# EAGLE design shield_008 (EAGLE 7.3.0)
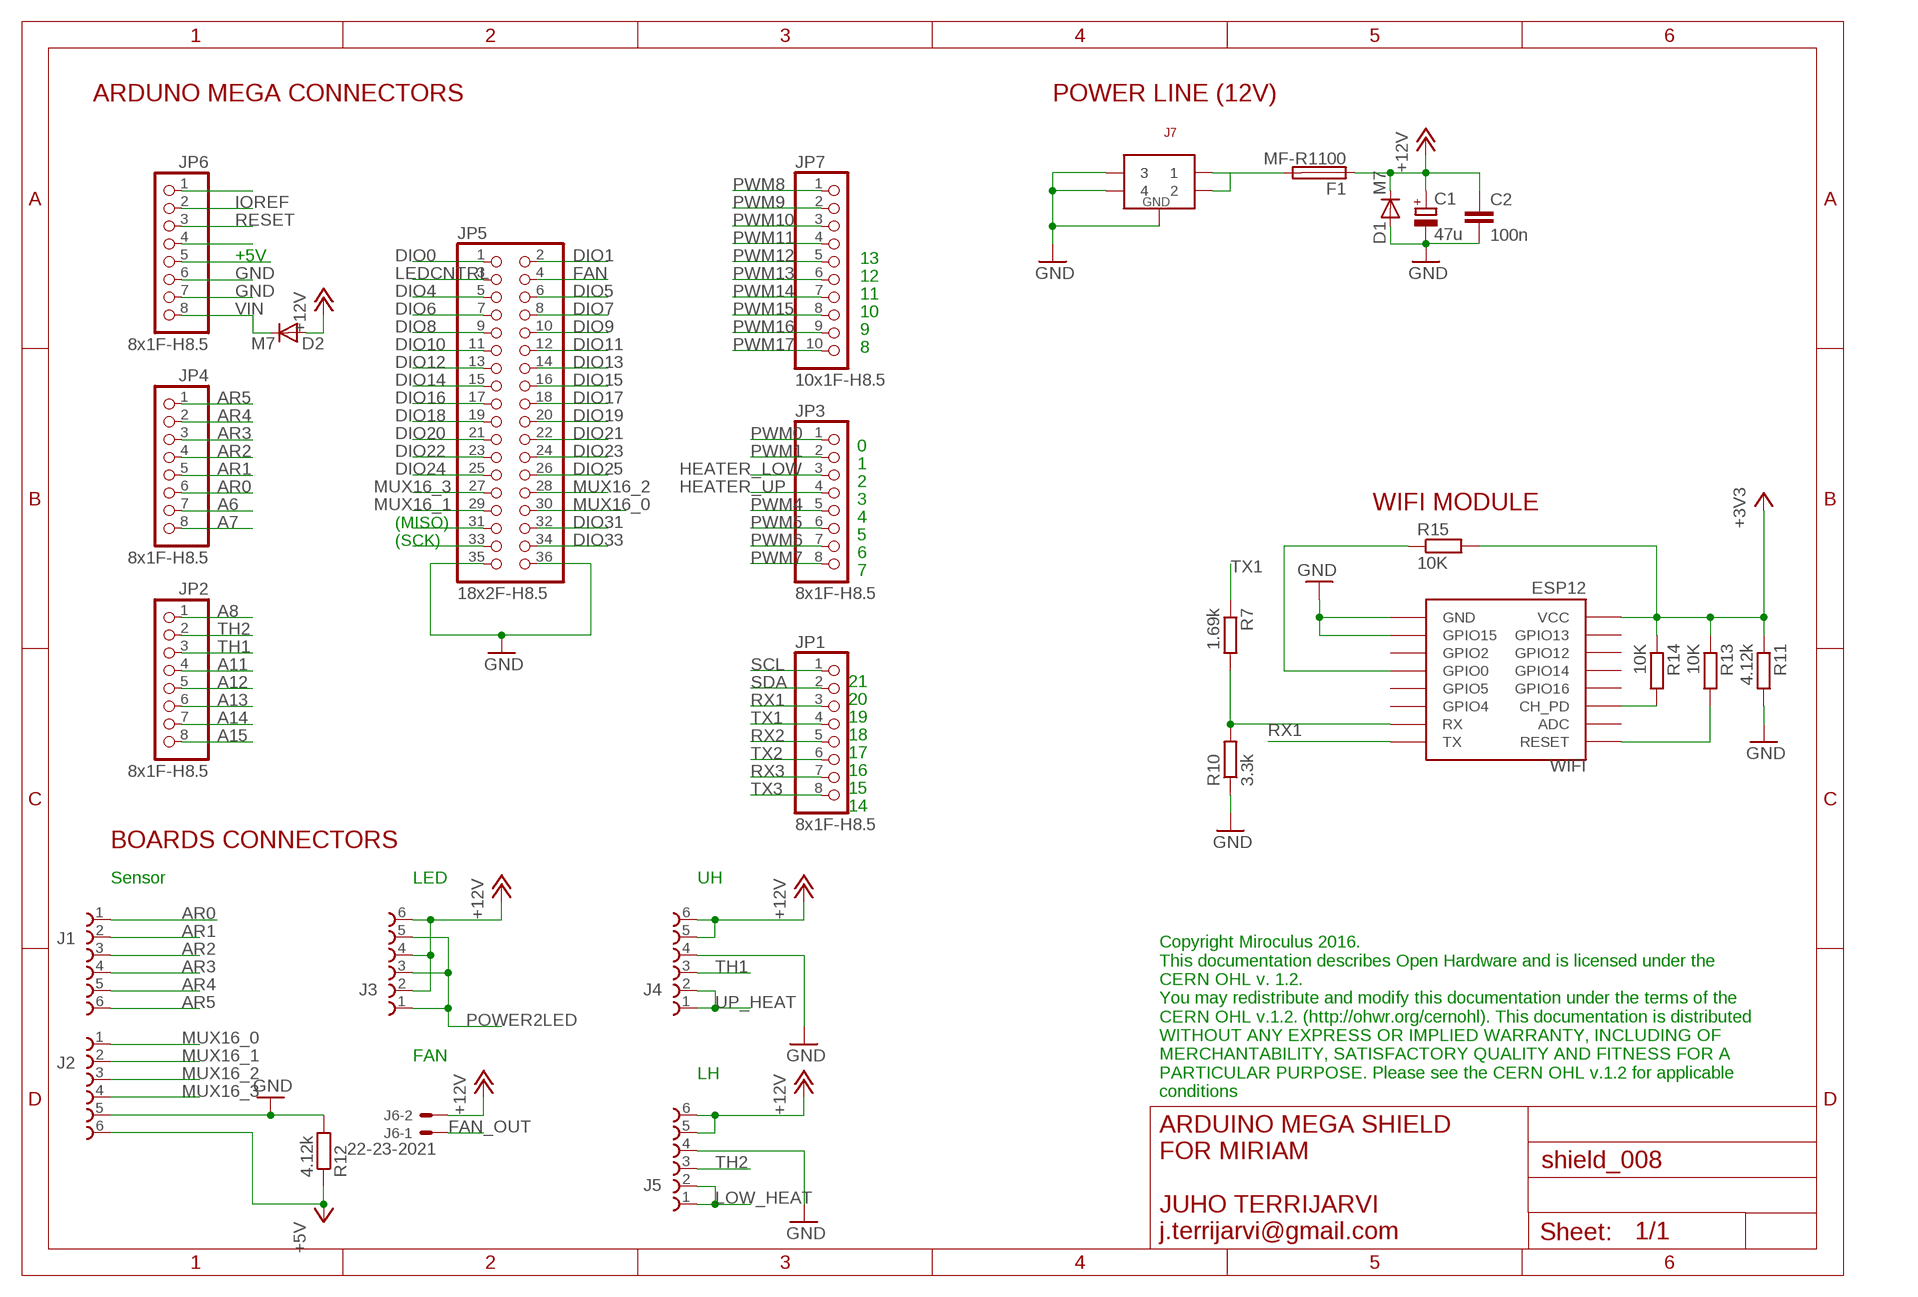
[diagram p0: schematic, sheet 1, part 1 of 2]
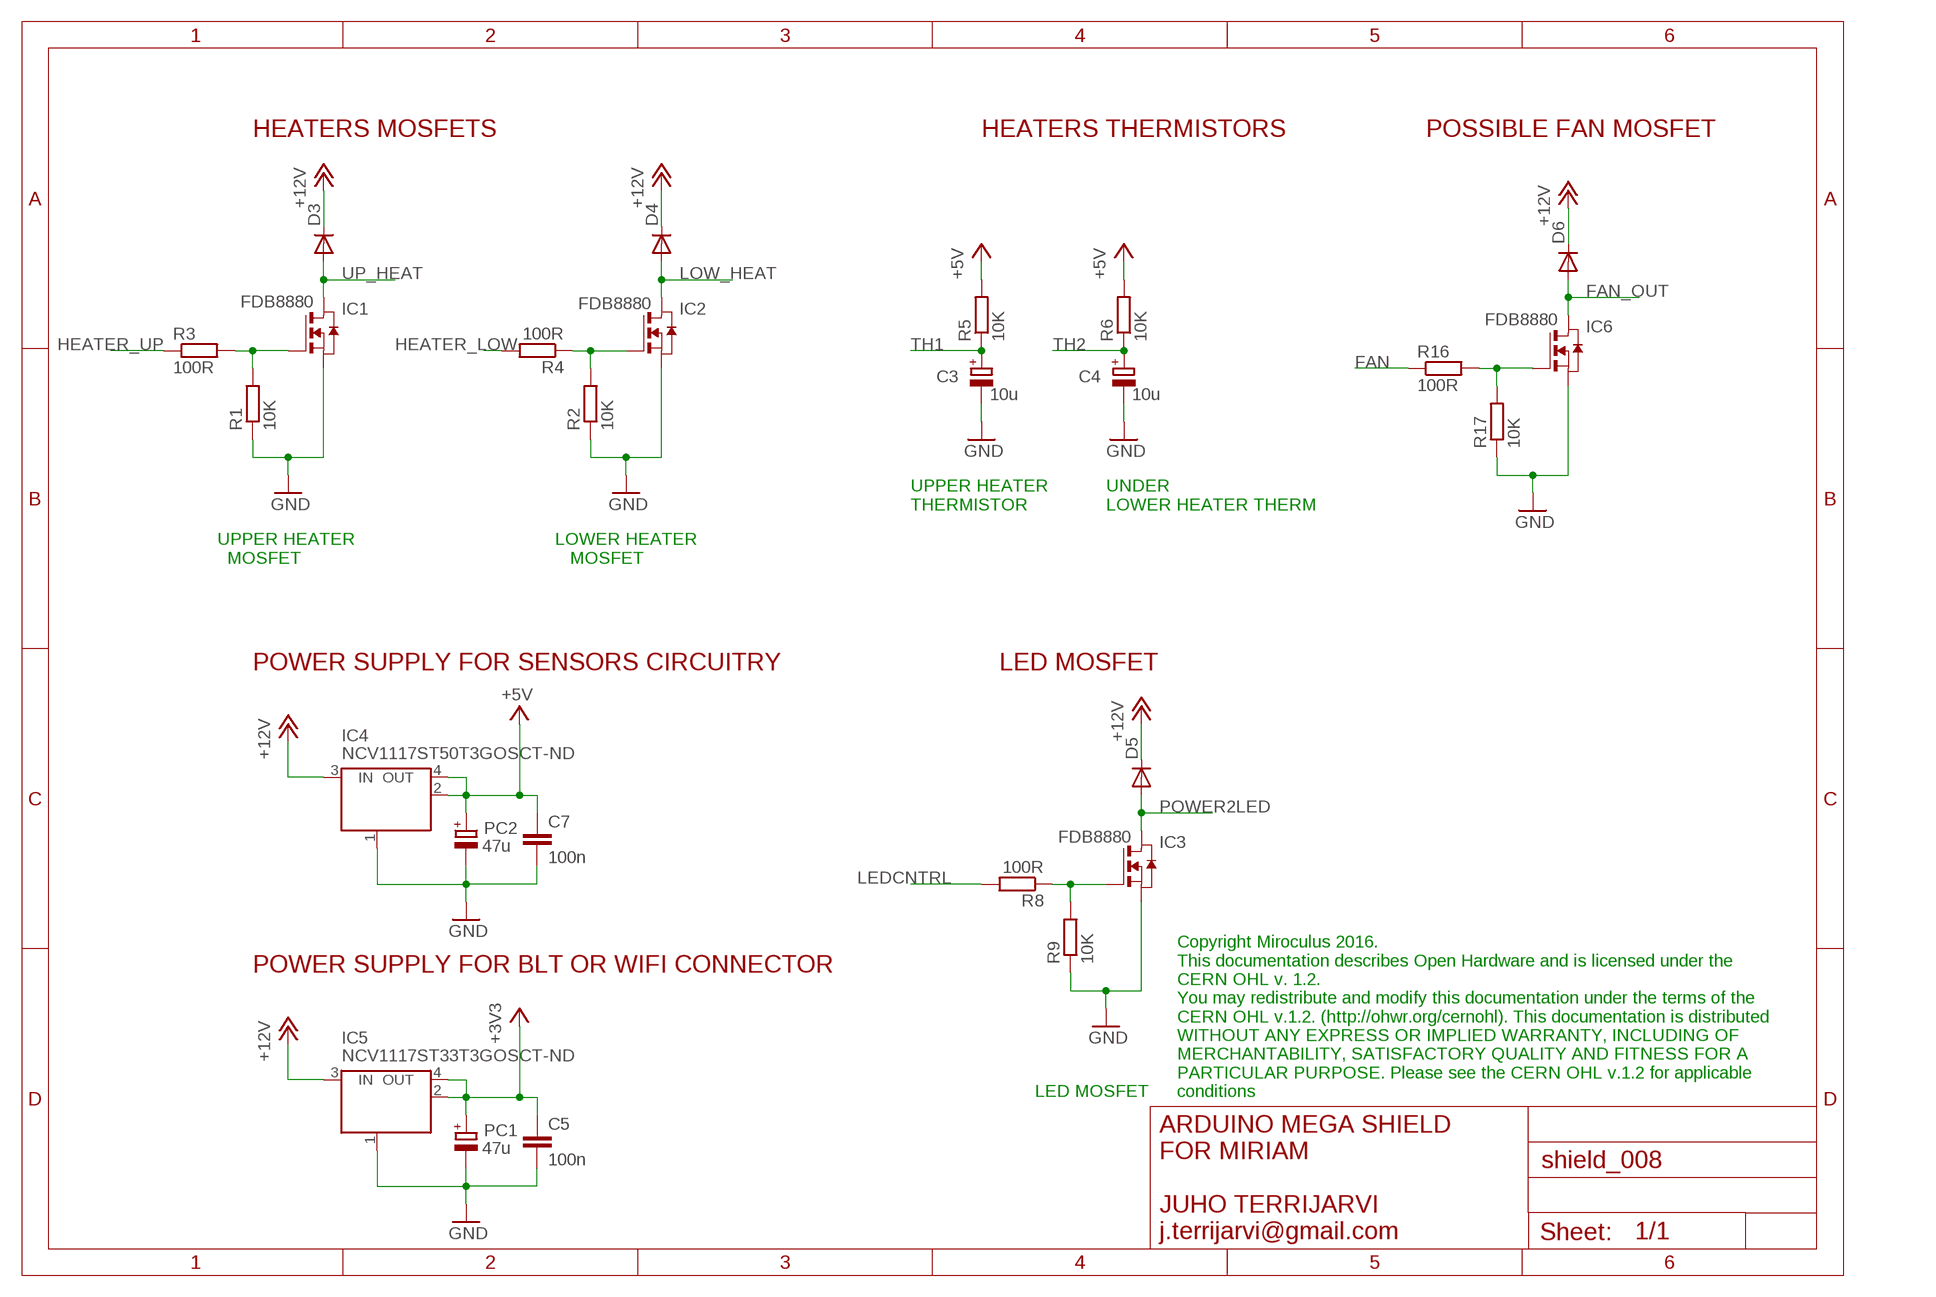
[diagram p1: schematic, sheet 1, part 2 of 2]

## Parts
C1  47u  CPOL-EUD  [PANASONIC_D]
C2  100n  C-EUC0603  [C0603]
C3  10u  CPOL-EUA/3216-18R  [A/3216-18R]
C4  10u  CPOL-EUA/3216-18R  [A/3216-18R]
C5  100n  C-EUC0603  [C0603]
C7  100n  C-EUC0603  [C0603]
D1  M7  DIODE-SMB  [SMB]
D2  M7  DIODE-SMB  [SMB]
D3  RGL34A  DO-213_DIODE  [DO-213AA_DIODE]
D4  RGL34A  DO-213_DIODE  [DO-213AA_DIODE]
D5  RGL34A  DO-213_DIODE  [DO-213AA_DIODE]
D6  RGL34A  DO-213_DIODE  [DO-213AA_DIODE]
F1  MF-R1100  LITTLEFUSE  [LITTLEFUSE]
IC1  FDB8880  [FDB8880]
IC2  FDB8880  [FDB8880]
IC3  FDB8880  [FDB8880]
IC4  NCV1117ST50T3GOSCT-ND  MC33269ST-3.3T3  [SOT223]
IC5  NCV1117ST33T3GOSCT-ND  MC33269ST-3.3T3  [SOT223]
IC6  FDB8880  [FDB8880]
J1  68710614522  [68710614522]
J2  68710614522  [68710614522]
J3  68710614522  [68710614522]
J4  68710614522  [68710614522]
J5  68710614522  [68710614522]
J6  22-23-2021  [22-23-2021]
J7  KPJX-4S-S  [KPJX-4S-S]
JP1  8x1F-H8.5  PINHD-1X8  [1X08]
JP2  8x1F-H8.5  PINHD-1X8  [1X08]
JP3  8x1F-H8.5  PINHD-1X8  [1X08]
JP4  8x1F-H8.5  PINHD-1X8  [1X08]
JP5  18x2F-H8.5  PINHD-2X18  [2X18]
JP6  8x1F-H8.5  PINHD-1X8  [1X08]
JP7  10x1F-H8.5  PINHD-1X10_ARD  [1X10]
PC1  47u  CPOL-EUD  [PANASONIC_D]
PC2  47u  CPOL-EUD  [PANASONIC_D]
R1  10K  R-EU_R0603  [R0603]
R2  10K  R-EU_R0603  [R0603]
R3  100R  R-EU_R0603  [R0603]
R4  100R  R-EU_R0603  [R0603]
R5  10K  R-EU_R0603  [R0603]
R6  10K  R-EU_R0603  [R0603]
R7  1.69k  R-EU_R0603  [R0603]
R8  100R  R-EU_R0603  [R0603]
R9  10K  R-EU_R0603  [R0603]
R10  3.3k  R-EU_R0603  [R0603]
R11  4.12k  R-EU_R0603  [R0603]
R12  4.12k  R-EU_R0603  [R0603]
R13  10K  R-EU_R0603  [R0603]
R14  10K  R-EU_R0603  [R0603]
R15  10K  R-EU_R0603  [R0603]
R16  100R  R-EU_R0603  [R0603]
R17  10K  R-EU_R0603  [R0603]
WIFI  ESP12  [ESP12]

## Nets
+3V3: C5.1 IC5.2(OUT) IC5.4(OUT) PC1.+ R11.1 R13.1 R14.1 R15.2 WIFI.VCC
+5V: C7.1 IC4.2(OUT) IC4.4(OUT) J2.6 PC2.+ R5.2 R6.2 R12.1
+12V: C1.+ C2.1 D1.C D2.A D3.P$2(C) D4.P$2(C) D5.P$2(C) D6.P$2(C) F1.1 IC4.3(IN) IC5.3(IN) J3.2 J3.4 J3.6 J4.5 J4.6 J5.5 J5.6 J6.2
A6: JP4.7
A7: JP4.8
A8: JP2.1
A11: JP2.4
A12: JP2.5
A13: JP2.6
A14: JP2.7
A15: JP2.8
AR0: J1.1 JP4.6
AR1: J1.2 JP4.5
AR2: J1.3 JP4.4
AR3: J1.4 JP4.3
AR4: J1.5 JP4.2
AR5: J1.6 JP4.1
DIO0: JP5.1
DIO1: JP5.2
DIO4: JP5.5
DIO5: JP5.6
DIO6: JP5.7
DIO7: JP5.8
DIO8: JP5.9
DIO9: JP5.10
DIO10: JP5.11
DIO11: JP5.12
DIO12: JP5.13
DIO13: JP5.14
DIO14: JP5.15
DIO15: JP5.16
DIO16: JP5.17
DIO17: JP5.18
DIO18: JP5.19
DIO19: JP5.20
DIO20: JP5.21
DIO21: JP5.22
DIO22: JP5.23
DIO23: JP5.24
DIO24: JP5.25
DIO25: JP5.26
DIO30: JP5.31
DIO31: JP5.32
DIO32: JP5.33
DIO33: JP5.34
FAN: JP5.4 R16.1
FAN_OUT: D6.P$1(A) IC6.2(D) J6.1
GND: C1.- C2.2 C3.- C4.- C5.2 C7.2 D1.A IC1.3(S) IC2.3(S) IC3.3(S) IC4.1(GND/ADJ) IC5.1(GND/ADJ) IC6.3(S) J2.5 J4.4 J5.4 J7.P$3 J7.P$4 J7.P$5(G) J7.P$6(G) J7.P$7(G) JP5.35 JP5.36 JP6.6 JP6.7 PC1.- PC2.- R1.1 R2.1 R9.1 R10.1 R11.2 R12.2 R17.1 WIFI.GND WIFI.GPIO15
HEATER_LOW: JP3.3 R4.2
HEATER_UP: JP3.4 R3.1
IOREF: JP6.2
LEDCNTRL: JP5.3 R8.2
LOW_HEAT: D4.P$1(A) IC2.2(D) J5.1 J5.2
MUX16_0: J2.1 JP5.30
MUX16_1: J2.2 JP5.29
MUX16_2: J2.3 JP5.28
MUX16_3: J2.4 JP5.27
N$1: JP6.1
N$2: JP6.5
N$4: IC3.1(G) R8.1 R9.2
N$5: R7.2 R10.2 WIFI.RX
N$6: JP6.4
N$10: R13.2 WIFI.RESET
N$11: R14.2 WIFI.CH_PD
N$13: R15.1 WIFI.GPIO0
N$14: F1.2 J7.P$1 J7.P$2
N$15: IC6.1(G) R16.2 R17.2
N$18: IC1.1(G) R1.2 R3.2
N$19: IC2.1(G) R2.2 R4.1
POWER2LED: D5.P$1(A) IC3.2(D) J3.1 J3.3 J3.5
PWM0: JP3.1
PWM1: JP3.2
PWM4: JP3.5
PWM5: JP3.6
PWM6: JP3.7
PWM7: JP3.8
PWM8: JP7.1
PWM9: JP7.2
PWM10: JP7.3
PWM11: JP7.4
PWM12: JP7.5
PWM13: JP7.6
PWM14: JP7.7
PWM15: JP7.8
PWM16: JP7.9
PWM17: JP7.10
RESET: JP6.3
RX1: JP1.3 WIFI.TX
RX2: JP1.5
RX3: JP1.7
SCL: JP1.1
SDA: JP1.2
TH1: C3.+ J4.3 JP2.3 R5.1
TH2: C4.+ J5.3 JP2.2 R6.1
TX1: JP1.4 R7.1
TX2: JP1.6
TX3: JP1.8
UP_HEAT: D3.P$1(A) IC1.2(D) J4.1 J4.2
VIN: D2.C JP6.8
Unconnected: WIFI.ADC WIFI.GPIO2 WIFI.GPIO4 WIFI.GPIO5 WIFI.GPIO12 WIFI.GPIO13 WIFI.GPIO14 WIFI.GPIO16

## Notes on the sheet
- ARDUNO MEGA CONNECTORS | POWER LINE (12V)
- HEATERS MOSFETS | HEATERS THERMISTORS | POSSIBLE FAN MOSFET
- +5V | 13
- 12
- 11
- 10
- 9
- 8
- 0
- 1
- 2
- 3
- 4 | WIFI MODULE
- UPPER HEATER
  THERMISTOR
- UNDER
  LOWER HEATER THERM
- (MISO) | 5
- (SCK) | 6
- 7
- UPPER HEATER
    MOSFET
- LOWER HEATER
     MOSFET
- 21 | POWER SUPPLY FOR SENSORS CIRCUITRY | LED MOSFET
- 20
- 19
- 18
- 17
- 16
- 15
- 14
- BOARDS CONNECTORS
- Sensor | LED | UH
- POWER SUPPLY FOR BLT OR WIFI CONNECTOR
- FAN
- LH
- Copyright Miroculus 2016.
  This documentation describes Open Hardware and is licensed under the
  CERN OHL v. 1.2.
  You may redistribute and modify this documentation under the terms of the
  CERN OHL v.1.2. (http://ohwr.org/cernohl). This documentation is distributed
  WITHOUT ANY EXPRESS OR IMPLIED WARRANTY, INCLUDING OF
  MERCHANTABILITY, SATISFACTORY QUALITY AND FITNESS FOR A
  PARTICULAR PURPOSE. Please see the CERN OHL v.1.2 for applicable
  conditions
- LED MOSFET
- Copyright Miroculus 2016.
  This documentation describes Open Hardware and is licensed under the
  CERN OHL v. 1.2.
  You may redistribute and modify this documentation under the terms of the
  CERN OHL v.1.2. (http://ohwr.org/cernohl). This documentation is distributed
  WITHOUT ANY EXPRESS OR IMPLIED WARRANTY, INCLUDING OF
  MERCHANTABILITY, SATISFACTORY QUALITY AND FITNESS FOR A
  PARTICULAR PURPOSE. Please see the CERN OHL v.1.2 for applicable
  conditions
- ARDUINO MEGA SHIELD
  FOR MIRIAM
  
  JUHO TERRIJARVI
  j.terrijarvi@gmail.com
- ARDUINO MEGA SHIELD
  FOR MIRIAM
  
  JUHO TERRIJARVI
  j.terrijarvi@gmail.com

## Library data of the parts
C1 C3 C4 PC1 PC2 = rcl:CPOL-EU: POLARIZED CAPACITOR, European symbol
C2 C5 C7 = rcl:C-EU: CAPACITOR, European symbol
D1 D2 = diode:DIODE-: DIODE
D3-D6 = verkstad:DO-213_DIODE: RGL34A thru RGL34K Surface Mount Glass Passivated Junction Fast Switching Rectifier
F1 = fuse:LITTLEFUSE: LITTLEFUSE Picofuse/slow Littlefuse; FARNELL: 1652183; OC_FARNELL: unknown; OC_NEWARK: unknown
IC1-IC3 IC6 = verkstad:FDB8880: FDB8880 N-Channel PowerTrench MOSFET This N-Channel MOSFET has been designed specifically to improve the overall efficiency of DC/DC converters using either synchronous or conventional switching PWM controllers. It has been optimized for low gate charge, low rDS(ON) and fast switching speed. Digikey Part Number: FDD8880CT-ND
IC4 IC5 = linear:MC33269ST*: Adjustable Output Low Dropout Voltage Regulator 800 mA Source: http://www.onsemi.com/pub/Collateral/MC33269-D.PDF
J1-J5 = Eagle_FPC_CONNECTOR_AND_FFC_CAB (rev18c):68710614522: WE-FPC 0.5mm SMT ZIF Horizontal Bottom Contact, 6 Pins=>Code : Con_FPC_ZIF_0.50_68710614522 <http://katalog.we-online.de/media/images/eican/Con_FPC_ZIF_0.50_6871xx14522_pf2.jpg> Details see: http://katalog.we-online.de/en/em/687_1xx_145_22 Created 2014-07-09, Karrer Zheng 2014 (C) Würth Elektronik
J6 = con-molex:22-23-2021: .100" (2.54mm) Center Header - 2 Pin; MF: MOLEX; MPN: 22-23-2021; OC_FARNELL: 1462926; OC_NEWARK: 25C3832
J7 = KPJX-4S-S:KPJX-4S-S; AVAILABILITY: Unavailable; DESCRIPTION: 4 _Power_ Position Circular Connector Jack, Female Sockets Solder; MF: Kycon; MP: KPJX-4S-S; PACKAGE: SOIC-20 Kycon; PRICE: None
JP1-JP4 JP6 = SmartPrj:PINHD-1X8: PIN HEADER
JP5 = SmartPrj:PINHD-2X18: PIN HEADER
JP7 = SmartPrj:PINHD-1X10_ARD: PIN HEADER
R1-R17 = rcl:R-EU_: RESISTOR, European symbol
WIFI = esp8266modules:ESP12: ESP8266 Wifi module 12

## Net classes
1 power: width 0.61 mm, drill 0.406 mm, clearance 0.203 mm
2 gnd: width 0.305 mm, drill 0.406 mm, clearance 0.203 mm
3 power usb: width 0.508 mm, drill 0.406 mm, clearance 0.203 mm
4 power12: width 1.905 mm, drill 0.813 mm, clearance 0.203 mm

## Board
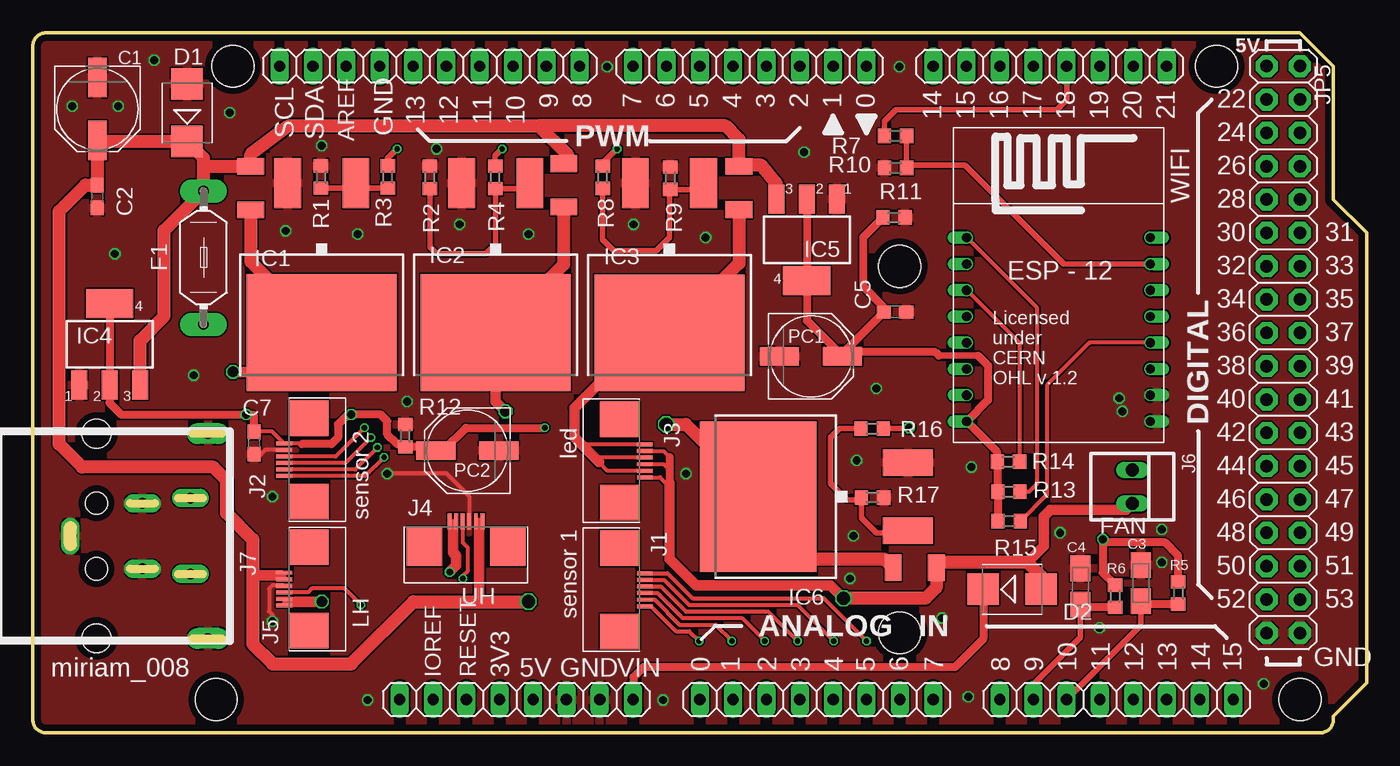
[diagram p2: board, top side]
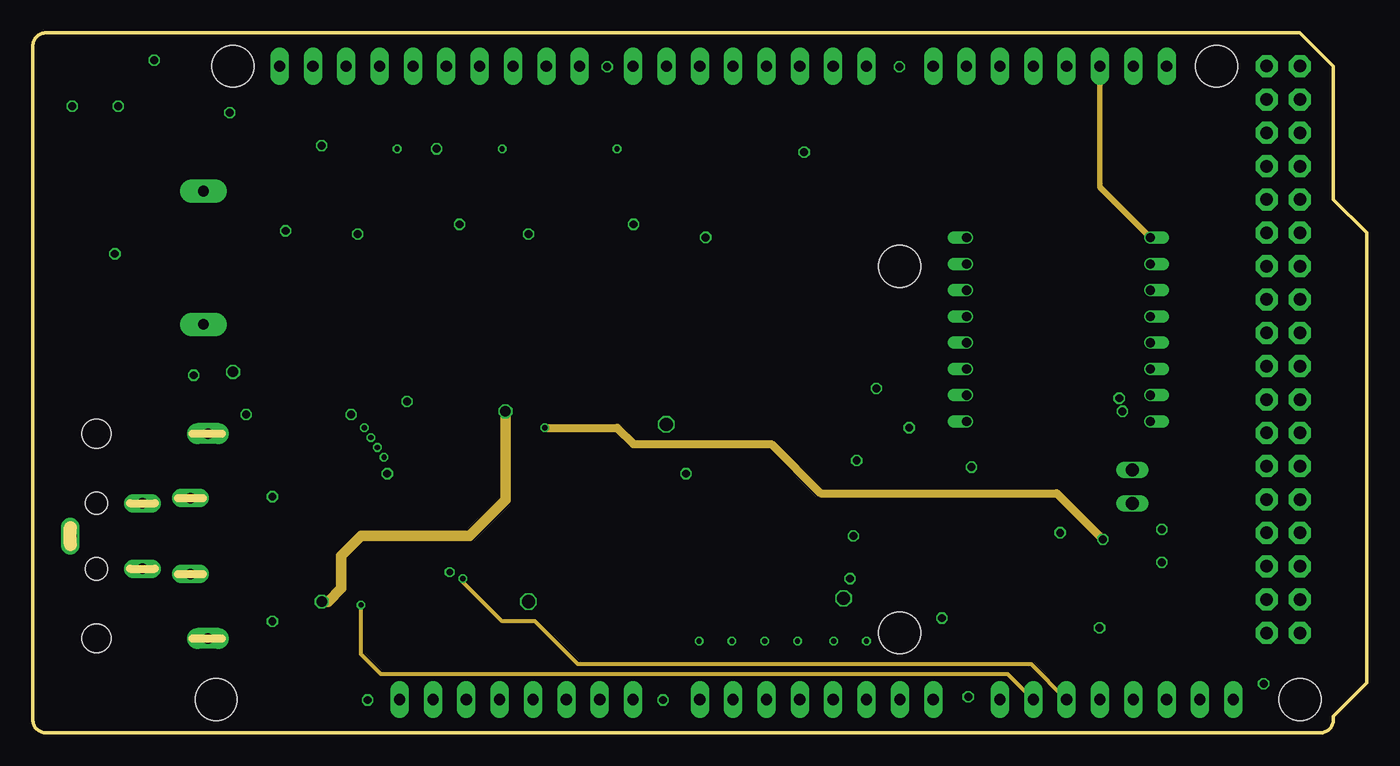
[diagram p3: board, inner layer Route2]
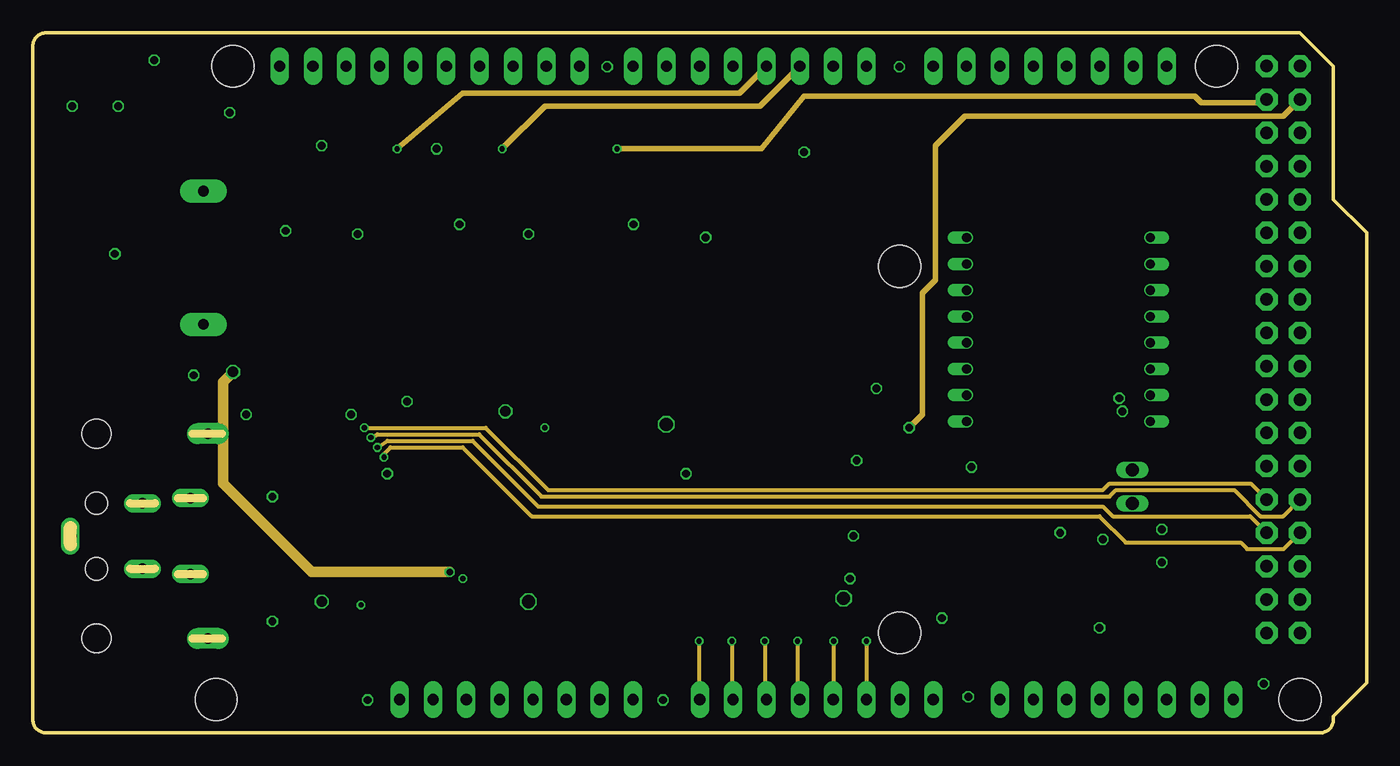
[diagram p4: board, inner layer Route15]
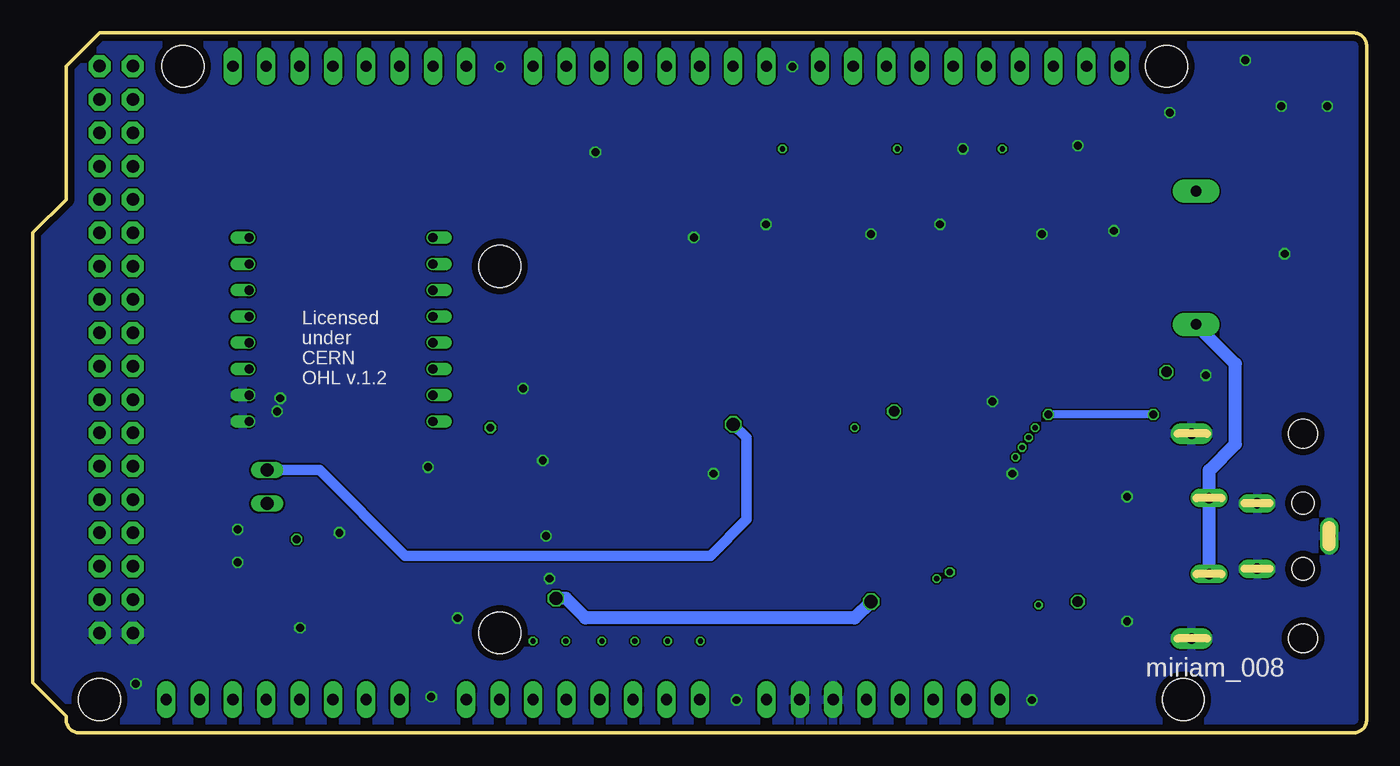
[diagram p5: board, bottom side, seen from below]

Size 101.6 x 53.34 mm. Coordinates in mm from the lower left corner, seen from the top.
Outline: 96.52,53.34 99.06,50.8 99.06,40.64 101.6,38.1 101.6,3.81 99.06,1.27 99.06,1 arc-90 98.06,0 1,0 arc-90 0,1 0,52.34 arc-90 1,53.34 96.52,53.34
Copper layers (1+2*15+16): Top 0.035mm / dielectric 1.5mm / Route2 0.035mm / dielectric 0.15mm / Route15 0.035mm / dielectric 0.2mm / Bottom 0.035mm
Design rules "default *": minimum track width 9mil, minimum drill 12mil, track to track 5mil, track to pad 5mil, pad to pad 5mil, via to via 5mil, smd to smd 0mil, copper to edge 20mil, drill to drill 8mil, minimum pad ring 5mil, minimum via ring 5mil, stop-mask expansion 4mil, vias tented up to drill 0mil, thermal gap 5mil
Holes 3.2 mm at 96.52,2.54 15.24,50.8 90.17,50.8 13.97,2.54 66.04,35.56 66.04,7.62

### Footprints (pad centres in the part's own frame; a part is rotated, then mirrored left to right if it is on the bottom)
PANASONIC_D = smd 3 x 1.4: + 2.4,0; - -2.4,0
C0603 = smd 1.1 x 1: 1 -0.85,0; 2 0.85,0
A/3216-18R = smd 1.95 x 1.5: + 1.375,0; - -1.375,0
SMB = smd 2.4 x 2.4: A 2.2,0; C -2.2,0
DO-213AA_DIODE = smd 1.27 x 2.032: P$1 -1.651,0; P$2 1.651,0
LITTLEFUSE = drill 0.813 pad 1.778 long: 1 -5.08,0; 2 5.08,0
FDB8880 = smd 2.032 x 3.81: 1 -2.595,-8.89; 3 2.595,-8.89 | smd 11.43 x 8.89: 2 0,2.5
SOT223 = smd 1.219 x 2.235: 1 -2.311,-3.099; 2 0,-3.099; 3 2.311,-3.099 | smd 3.6 x 2.2: 4 0,3.099
68710614522 = smd 0.3 x 1.2: 1 -1.25,1.9; 2 -0.75,1.9; 3 -0.25,1.9; 4 0.25,1.9; 5 0.75,1.9; 6 1.25,1.9 | smd 2.7 x 3: Z1 -3.18,0; Z2 3.18,0
22-23-2021 = drill 1 long: 1 -1.27,0; 2 1.27,0
KPJX-4S-S = drill 0.8 pad 1.4 long: P$1 -2.9,0; P$2 2.9,0; P$3 -2.5,3.65; P$4 2.5,3.65 | drill 1 pad 1.4 long: P$5 0,9.15 | drill 0.8 pad 1.6 long: P$6 -7.8,-1.35; P$7 7.8,-1.35 | hole 2.2: -7.8,7.15; 7.8,7.15 | hole 1.7: -2.5,7.15; 2.5,7.15
1X08 = drill 0.85 pad 1.422 long: 1 -8.89,0; 2 -6.35,0; 3 -3.81,0; 4 -1.27,0; 5 1.27,0; 6 3.81,0; 7 6.35,0; 8 8.89,0
2X18 = drill 0.95 pad 1.676 octagon: 1 -21.59,-1.27; 2 -21.59,1.27; 3 -19.05,-1.27; 4 -19.05,1.27; 5 -16.51,-1.27; 6 -16.51,1.27; 7 -13.97,-1.27; 8 -13.97,1.27; 9 -11.43,-1.27; 10 -11.43,1.27; 11 -8.89,-1.27; 12 -8.89,1.27; 13 -6.35,-1.27; 14 -6.35,1.27; 15 -3.81,-1.27; 16 -3.81,1.27; 17 -1.27,-1.27; 18 -1.27,1.27; 19 1.27,-1.27; 20 1.27,1.27; 21 3.81,-1.27; 22 3.81,1.27; 23 6.35,-1.27; 24 6.35,1.27; 25 8.89,-1.27; 26 8.89,1.27; 27 11.43,-1.27; 28 11.43,1.27; 29 13.97,-1.27; 30 13.97,1.27; 31 16.51,-1.27; 32 16.51,1.27; 33 19.05,-1.27; 34 19.05,1.27; 35 21.59,-1.27; 36 21.59,1.27
1X10 = drill 0.85 pad 1.422 long: 1 -11.43,0; 2 -8.89,0; 3 -6.35,0; 4 -3.81,0; 5 -1.27,0; 6 1.27,0; 7 3.81,0; 8 6.35,0; 9 8.89,0; 10 11.43,0
R0603 = smd 1 x 1.1: 1 -0.85,0; 2 0.85,0
ESP12 = drill 0.7 offset: ADC -7.1,3.8; CH_PD -7.1,1.8; GND 6.9,-8.2; GPIO0 6.9,-2.2; GPIO2 6.9,-4.2; GPIO4 6.9,1.8; GPIO5 6.9,-0.2; GPIO12 -7.1,-4.2; GPIO13 -7.1,-6.2; GPIO14 -7.1,-2.2; GPIO15 6.9,-6.2; GPIO16 -7.1,-0.2; RESET -7.1,5.8; RX 6.9,3.8; TX 6.9,5.8; VCC -7.1,-8.2

### Placement (x,y rotation side)
C1  4.92,47.53 270 top
C2  4.9,40.85 270 top
C3  84.4,11.41 270 top
C4  79.79,11.16 270 top
C5  65.68,32.08 0 top
C7  16.85,22.1 270 top
D1  11.75,47.25 90 top
D2  74.6,10.95 0 top
D3  16.59,41.5 90 top
D4  40.44,41.72 90 top
D5  53.79,41.52 90 top
D6  67.18,12.58 0 top
F1  13,36.2 270 top
IC1  22,33 180 top
IC2  35.25,33 180 top
IC3  48.49,32.99 180 top
IC4  5.85,29.6 0 top
IC5  58.95,37.57 180 top
IC6  57.75,18 90 top
J1  44.71,10.91 270 top
J2  21.04,20.81 90 top
J3  44.71,20.72 270 top
J4  32.99,14.21 0 top
J5  21.04,10.96 90 top
J6  83.75,18.75 270 top
J7  12,15 90 top
JP1  77.47,50.8 180 top
JP2  82.55,2.54 0 top
JP3  54.61,50.8 180 top
JP4  59.69,2.54 0 top
JP5  95.25,29.21 270 top
JP6  36.83,2.54 0 top
JP7  30.23,50.8 0 top
PC1  59.27,28.69 0 top
PC2  33.1,21.5 180 top
R1  21.96,42.35 270 top
R2  30.25,42.32 270 top
R3  27.03,42.35 270 top
R4  35.22,42.32 90 top
R5  87.25,10.66 90 top
R6  82.44,10.41 90 top
R7  65.71,45.49 0 top
R8  43.4,42.34 90 top
R9  48.55,42.26 270 top
R10  65.71,43.05 0 top
R11  65.6,39.26 0 top
R12  28.36,22.64 90 top
R13  74.35,18.39 0 top
R14  74.32,20.65 0 top
R15  74.37,16.13 180 top
R16  63.93,23.19 180 top
R17  63.96,17.94 180 top
WIFI  78.23,31.93 0 top

### Tracks (layer width: path | path; a pad name or v marks a point on that pad's centre or on a via)
+3V3
  Top 0.5: 69,28.75 72,28.75
  Top 0.6: IC5.2 IC5.4 58.95,31.41 61.36,29 | 61.36,29 PC1.+ 61.67,28.92 C5.1 64.83,32.42 63.25,34 63.25,37.77 R11.1 | R15.2 73.5,16.15 R13.1 73.47,18.41 R14.1 73.47,21.39 WIFI.VCC 72.75,25.35 72.75,28 72,28.75 | 61.36,29 68.75,29 69,28.75
+5V  (via drill 0.4, 0.6)
  Top 0.3: C7.1 18.25,22.95 J2.6 20.44,22.06 20.5,22
  Top 0.6: IC4.4 IC4.2 5.85,25.15 6.75,24.25 v16.25,24.25 16.75,24.25 16.85,24.15 C7.1 | 20.5,22 22.75,22 23.25,22.5 23.25,23.5 24,24.25 v24.25,24.25 26.5,24.25 27,23.75 27,22.75 27.75,22 28.14,22 R12.1 30.41,21.79 PC2.+ 31.25,21.5 33,23.25 v39,23.25 | R6.2 81.5,12.2 v81.5,14.75 81.75,14.5 86.25,14.5 87.25,13.5 R5.2
  Route2 0.6: v39,23.25 44.5,23.25 45.75,22 56.25,22 60,18.25 78,18.25 v81.5,14.75
  Bottom 0.6: v16.25,24.25 v24.25,24.25
+12V  (via drill 1)
  Top 0.3: J5.5 J5.6 18.93,12 | J4.5 J4.6 34.13,16 34,16 | J3.2 48.03,21.47 48.5,21 | J3.4 48.03,20.47 48.5,20 | J3.6 47.78,19.47 48.5,18.75
  Top 0.6: 48.5,21 48.5,20 48.5,19
  Top 0.8: 18.93,12 16.75,12 | J6.2 83.27,17 77.5,17 77,16.5 77,14.25 75.75,13 | 34,16 34,10 | 48.5,19 48.5,18.75 48.5,13.25 50.5,11.25 60.75,11.25 v61.75,10.25
  Top 1: 13,43.25 F1.1 10,38.28 10,31.75 8.16,29.91 IC4.3 | 13,43.25 13,43.8 D1.C 5,45.05 C1.+ 4.92,41.72 C2.1 4.85,41.75 4,41.75 2,39.75 2,22 3.75,20.25 13.75,20.25 14.75,19.25 14.75,16.75 16.75,14.75 16.75,12 16.75,6.75 18.25,5.25 24.25,5.25 29,10 34,10 v37.75,10 | 13,43.25 13.1,43.15 D3.P$2 16.59,44.09 19.5,46.25 38.5,46.25 | 38.5,46.25 40.75,44 40.75,43.69 D4.P$2 | 38.5,46.25 52.75,46.25 53.79,45.21 D5.P$2 53.37,43.25 55.5,43.25 56.64,41.86 IC5.3 | D2.A 76.8,11.95 75.75,13 69.24,13 D6.P$2 68.83,11.08 68,10.25 v61.75,10.25
  Bottom 1: v37.75,10 39,8.75 59.5,8.75 61,10.25 v61.75,10.25
AR0  (via drill 0.4)
  Top 0.3: J1.1 48.34,12.16 50.25,10.25 60.25,10.25 v63.5,7
  Route15 0.3: v63.5,7 JP4.6
AR1  (via drill 0.4)
  Top 0.3: J1.2 48.09,11.66 50,9.75 58.25,9.75 v61,7
  Route15 0.3: v61,7 61,2.58 JP4.5
AR2  (via drill 0.4)
  Top 0.3: J1.3 47.84,11.16 49.75,9.25 56,9.25 v58.25,7
  Route15 0.3: v58.25,7 58.25,2.71 JP4.4
AR3  (via drill 0.4)
  Top 0.3: J1.4 47.59,10.66 49.5,8.75 54,8.75 v55.75,7
  Route15 0.3: v55.75,7 55.75,2.67 JP4.3
AR4  (via drill 0.4)
  Top 0.3: J1.5 47.34,10.16 49.25,8.25 52,8.25 v53.25,7
  Route15 0.3: v53.25,7 53.25,2.63 JP4.2
AR5  (via drill 0.4)
  Top 0.3: J1.6 47.09,9.66 49,7.75 50,7.75 v50.75,7
  Route15 0.3: v50.75,7 50.75,2.59 JP4.1
FAN  (via drill 0.6)
  Top 0.4: R16.1 66.69,23.19 v66.75,23.25
  Route15 0.4: v66.75,23.25 67.75,24.25 67.75,33.5 68.75,34.5 68.75,44.75 71,47 95.26,47 JP5.4
FAN_OUT  (via drill 1)
  Top 1: D6.P$1 64.86,13.25 58.5,13.25 55.25,16.5 IC6.2 49.75,23.5 v48.25,23.5
  Bottom 0.8: v48.25,23.5 47.25,22.5 47.25,16.25 50,13.5 73.25,13.5 79.77,20.02 J6.1
GND  (via drill 0.6)
  Top 0.3: J2.5 19.13,21.55 17.7,21.55 17.4,21.25 C7.2 | J5.4 19.1,11.25 18.25,11.25 18,11 18,9.25 18.25,9 v18.25,8.5 | J4.4 33.25,18 31.5,19.75 v27,19.75
  other vias: 32.5,38.75 45.75,38.75 19.25,38.25 58.75,44.25 6.25,36.5 3,47.75 6.5,47.75 15,47.25 9.25,51.25 25.5,2.5 49.75,19.75 69.25,8.75 62.75,20.75 78.25,15.25 86,15.5 83,24.5 82.75,25.5 66,50.75 43.75,50.75 51.25,37.75 37.75,38 24.75,38 22,44.75 30.75,44.5 71.25,2.75 48,2.5 93.75,3.75 64.25,26.25 62.5,15 62.25,11.75 81.25,8 71.5,20.25 18.25,18 28.5,25.25 12.25,27.25 86,13
  pour Top: 0.3,53.1 0.3,0.15 98.55,0.15 98.55,0.45 101.7,3.6 101.7,37.65 99.15,40.2 99.15,51 96.6,53.55
  pour Bottom: 0.3,53.1 0.3,0.45 98.4,0.45 98.4,0.6 101.55,3.75 101.55,37.95 99,40.5 99,51.15 96.75,53.4
HEATER_LOW  (via drill 0.4)
  Top 0.4: R4.2 35.22,43.97 v35.75,44.5
  Route15 0.4: v35.75,44.5 39,47.75 55.37,47.75 JP3.3
HEATER_UP  (via drill 0.4)
  Top 0.4: R3.1 27.03,43.78 v27.75,44.5
  Route15 0.4: v27.75,44.5 32.75,48.75 53.83,48.75 JP3.4
LEDCNTRL  (via drill 0.4)
  Top 0.4: R8.2 43.4,43.4 v44.5,44.5
  Route15 0.4: v44.5,44.5 55.5,44.5 58.75,48.5 88.5,48.5 89,48 93.72,48 JP5.3
LOW_HEAT  (via drill 0.8)
  Top 0.3: J5.2 J5.1 | J5.2 19.35,10 19.5,10 | 19.5,9.75 19.14,10.11 J5.2
  Top 0.4: 20,10 19.75,9.75 19.5,9.75
  Top 0.8: IC2.2 35.25,25.25 v36,24.5 | v22,10 20,10
  Top 1: D4.P$1 40.44,35.69 IC2.2
  Route2 0.8: v36,24.5 36,17.75 33.25,15 25,15 23.5,13.5 23.5,11 22.5,10 v22,10
MUX16_0  (via drill 0.4)
  Top 0.3: J2.1 25.31,19.56 v26.75,21
  Route15 0.3: v26.75,21 26.75,21.25 27.25,21.75 32.75,21.75 38,16.5 81.25,16.5 83.25,14.5 92,14.5 92.5,14 95.28,14 JP5.30
MUX16_1  (via drill 0.4)
  Top 0.3: J2.2 24.56,20.06 v26.25,21.75
  Route15 0.3: v26.25,21.75 27,22.25 33.5,22.25 38.5,17.25 81.5,17.25 82.25,16.5 92.72,16.5 JP5.29
MUX16_2  (via drill 0.4)
  Top 0.3: J2.3 23.81,20.56 v25.75,22.5
  Route15 0.3: v25.75,22.5 26.25,22.75 34,22.75 38.75,18 82,18 82.5,18.5 91.5,18.5 93.5,16.5 95.24,16.5 JP5.28
MUX16_3  (via drill 0.4)
  Top 0.3: v25.25,23.25 23.06,21.06 J2.4
  Route15 0.3: v25.25,23.25 34.5,23.25 39.25,18.5 81.5,18.5 82,19 92.76,19 JP5.27
N$4
  Top 0.4: IC3.1 50.62,41.41 R9.2 48.5,41.36 48.5,37.75 47.5,36.75 44.25,36.75 43.4,37.6 R8.1
N$5
  Top 0.4: WIFI.RX 78.52,35.73 71,43.25 66.76,43.25 R10.2 R7.2
N$10
  Top 0.3: R13.2 75.89,18.39 76.5,19 76.5,32.36 WIFI.RESET
N$11
  Top 0.3: R14.2 75.17,29.69 WIFI.CH_PD
N$13
  Top 0.3: WIFI.GPIO0 80.48,29.73 77.25,26.5 77.25,18.16 R15.1
N$14
  Bottom 1: J7.P$1 J7.P$2 12,20 10,22 10,28.12 F1.2
N$15
  Top 0.4: 63.08,17.97 R17.2 | R17.2 63.11,16.39 64.25,15.25 66.48,15.25 IC6.1 | R16.2 61.44,23.19 60.75,22.5 60.75,19 62,17.75 62.93,17.75 R17.2
N$18
  Top 0.4: R1.2 24.2,41.5 IC1.1 24.99,41.5 R3.2
N$19
  Top 0.4: IC2.1 37.43,41.47 R4.1 35.25,41.44 35.25,37.25 34.5,36.5 30.75,36.5 30.25,37 R2.2
POWER2LED
  Top 0.3: J3.1 41.78,21.97 | 41.78,21.97 41.25,22.5 | J3.3 42.78,20.97 | 42.78,20.97 41.78,21.97 | J3.5 43.78,19.97 43.12,20.62 42.78,20.97
  Top 0.8: IC3.2 46.99,30.49 41.25,24.75 41.25,22.5 43.12,20.62
  Top 1: D5.P$1 53.79,35.79 IC3.2
RX1
  Route2 0.4: JP1.3 81.28,41.58 WIFI.TX
TH1  (via drill 0.4)
  Top 0.3: J4.3 32.75,14.5 33.1,14.15 33.1,12.3 32.75,11.95 v32.75,11.75
  Top 0.4: C3.+ 84.4,8.2 JP2.3
  Top 0.6: R5.1 84.06,9.81 84,9.75 84.11,9.75 C3.+
  Route2 0.3: JP2.3 76.03,5.25 41.5,5.25 38.25,8.5 35.75,8.5 32.75,11.5 v32.75,11.75
TH2  (via drill 0.4)
  Top 0.3: v25,9.75 23.75,11 21.25,11 20.96,10.71 J5.3
  Top 0.4: C4.+ 79.79,7.29 76.25,3.75 76.25,2.59 JP2.2
  Top 0.6: R6.1 80.02,9.56 C4.+
  Route2 0.3: JP2.2 74.24,4.5 26.5,4.5 25,6 v25,9.75
TX1
  Top 0.4: R7.1 64.86,46.61 65.75,47.5 78,47.5 78.75,48.25 JP1.4
UP_HEAT  (via drill 0.5, 0.8)
  Top 0.3: J4.2 J4.1 31.75,16 32,15.75
  Top 0.8: v15.25,27.5 18.25,27.5 21.62,30.88 | v31.75,12.25 32.25,12.75 32.25,13.5 32,13.75 32,15.75
  Top 1: D3.P$1 16.59,35.91 21.62,30.88 IC1.2
  Route15 0.8: v31.75,12.25 21.25,12.25 14.5,19 14.5,26.75 v15.25,27.5
VIN
  Top 0.6: D2.C 72.4,7.15 70.25,5 46.5,5 45.75,4.25 45.75,2.57 JP6.8

### Text on the board
tPlace: 9 | 8 | 7 | 6 | 5 | 4 | 3 | 2 | 1 | 0 | 22 | 14 | 15 | 16 | 17 | 18 | 19 | 20 | 21 | 13 | 12 | 11 | 10 | 24 | 26 | 28 | 30 | 31 | 32 | 33 | 34 | 35 | 36 | 37 | 38 | 39 | 40 | 41 | 42 | 43 | 44 | 45 | 46 | 47 | 48 | 49 | 50 | 51 | 52 | 53 | 0 | 1 | 2 | 3 | 4 | 5 | 6 | 7 | 8 | 9 | 10 | 11 | 12 | 13 | 14 | 15
tNames: 5V | SCL | SDA | AREF | GND | PWM | Licensed / under / CERN / OHL v.1.2 | led | DIGITAL | sensor 2 | sensor 1 | FAN | UH | LH | ANALOG IN | GND | miriam_008 | IOREF | RESET | 3V3 | 5V | GND | VIN
bNames: Licensed / under / CERN / OHL v.1.2 | miriam_008